# Altium schematic sheet ad_1.schdoc
size A2
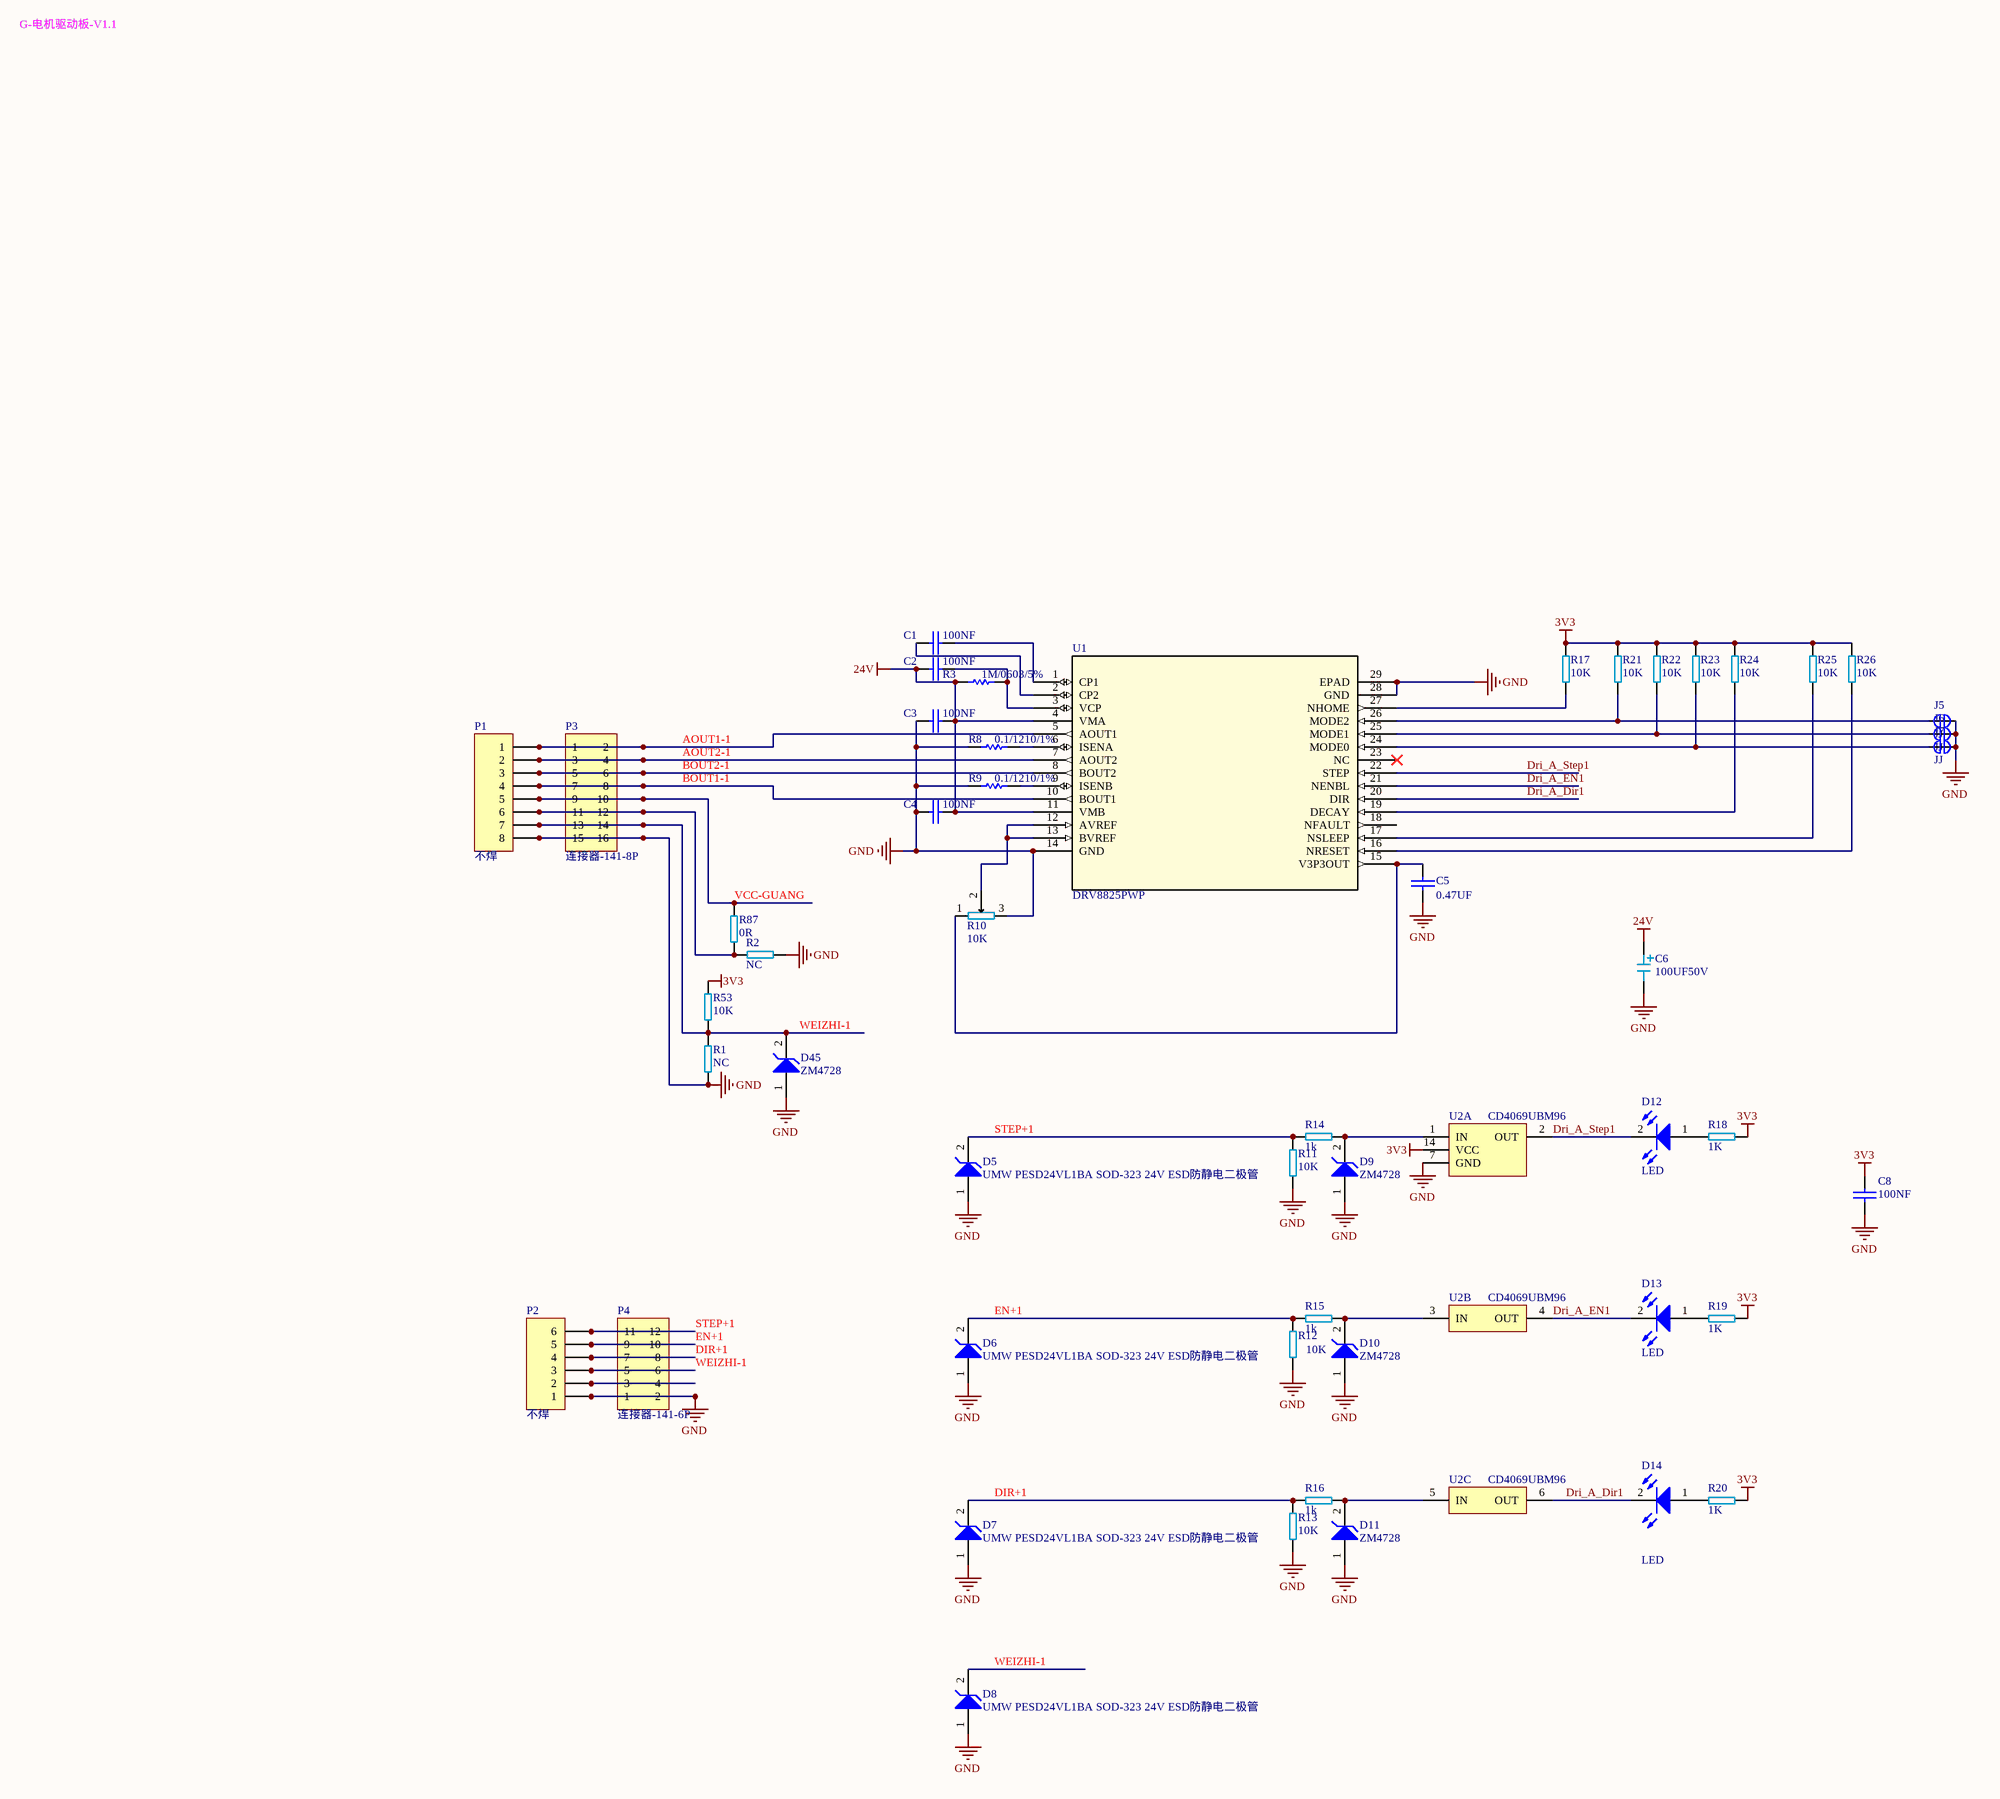
[diagram p0: ad_1.schdoc]

## Parts
C1  100NF  [C0603]
C2  100NF  [C0603]
C3  100NF  [C0603]
C4  100NF  [C0603]
C5  0.47UF  [C0603]
C6  100UF50V  [CE8]
C8  100NF  [C0603]
D5  UMW PESD24VL1BA SOD-323 24V ESD防静电二极管  [SOD323]
D6  UMW PESD24VL1BA SOD-323 24V ESD防静电二极管  [SOD323]
D7  UMW PESD24VL1BA SOD-323 24V ESD防静电二极管  [SOD323]
D8  UMW PESD24VL1BA SOD-323 24V ESD防静电二极管  [SOD323]
D9  ZM4728  [D1206]
D10  ZM4728  [D1206]
D11  ZM4728  [D1206]
D12  LED  [LED0603]
D13  LED  [LED0603]
D14  LED  [LED0603]
D45  ZM4728  [D1206]
J5  JJ  [TIAOXIAN-PAN]
J6  JJ  [TIAOXIAN-PAN]
J7  JJ  [TIAOXIAN-PAN]
P1  不焊  [SIP8]
P2  不焊  [SIP6]
P3  连接器-141-8P  [141V-8P]
P4  连接器-141-6P  [141V-6P]
R1  NC  [R0603]
R2  NC  [R0603]
R3  1M/0603/5%  [R0603]
R8  0.1/1210/1%  [R1210]
R9  0.1/1210/1%  [R1210]
R10  10K  [RR-MINI-SMD]
R11  10K  [R0603]
R12  10K  [R0603]
R13  10K  [R0603]
R14  1k  [R0603]
R15  1k  [R0603]
R16  1k  [R0603]
R17  10K  [R0603]
R18  1K  [R0603]
R19  1K  [R0603]
R20  1K  [R0603]
R21  10K  [R0603]
R22  10K  [R0603]
R23  10K  [R0603]
R24  10K  [R0603]
R25  10K  [R0603]
R26  10K  [R0603]
R53  10K  [R0603]
R87  0R  [R0603]
U1  DRV8825PWP  [HTSSOP28]
U2  CD4069UBM96  [SO14]  (parts A,B,C of 6)

## Nets
3V3: C8.2 R17.2 R18.2 R19.2 R20.2 R21.2 R22.2 R23.2 R24.2 R25.2 R26.2 R53.2 U2.14(VCC)
24V: C2.1 C3.2 C4.2 C6.1 R3.2 U1.4(VMA) U1.11(VMB)
GND: C3.1 C4.1 C5.1 C6.2 C8.1 D5.1 D6.1 D7.1 D8.1 D9.1 D10.1 D11.1 D45.1 J5.2 J6.2 J7.2 P1.8 P2.1 P3.15 P3.16 P4.1 P4.2 R1.1 R2.1 R8.2 R9.2 R10.3 R11.1 R12.1 R13.1 U1.14(GND) U1.28(GND) U1.29(EPAD) U2.7(GND)
AOUT1-1: P1.1 P3.1 P3.2 U1.5(AOUT1)
AOUT2-1: P1.2 P3.3 P3.4 U1.7(AOUT2)
BOUT1-1: P1.4 P3.7 P3.8 U1.10(BOUT1)
BOUT2-1: P1.3 P3.5 P3.6 U1.8(BOUT2)
DIR+1: D7.2 P2.4 P4.7 P4.8 R13.2 R16.2
Dri_A_Dir1: D14.2(K) U1.20(DIR) U2.6(OUT)
Dri_A_EN1: D13.2(K) U1.21(NENBL) U2.4(OUT)
Dri_A_Step1: D12.2(K) U1.22(STEP) U2.2(OUT)
EN+1: D6.2 P2.5 P4.9 P4.10 R12.2 R15.2
STEP+1: D5.2 P2.6 P4.11 P4.12 R11.2 R14.2
VCC-GUANG: P1.5 P3.9 P3.10 R87.2
WEIZHI-1: D8.2 D45.2 P1.7 P2.3 P3.13 P3.14 P4.5 P4.6 R1.2 R53.1
NetC1_1: C1.1 U1.2(CP2)
NetC1_2: C1.2 U1.1(CP1)
NetC2_2: C2.2 R3.1 U1.3(VCP)
NetC5_2: C5.2 R10.1 U1.15(V3P3OUT)
NetD9_2: D9.2 R14.1 U2.1(IN)
NetD10_2: D10.2 R15.1 U2.3(IN)
NetD11_2: D11.2 R16.1 U2.5(IN)
NetD12_1: D12.1(A) R18.1
NetD13_1: D13.1(A) R19.1
NetD14_1: D14.1(A) R20.1
NetJ5_1: J5.1 R21.1 U1.26(MODE2)
NetJ6_1: J6.1 R22.1 U1.25(MODE1)
NetJ7_1: J7.1 R23.1 U1.24(MODE0)
NetP1_6: P1.6 P3.11 P3.12 R2.2 R87.1
NetP2_2: P2.2 P4.3 P4.4
NetR8_1: R8.1 U1.6(ISENA)
NetR9_1: R9.1 U1.9(ISENB)
NetR10_2: R10.2 U1.12(AVREF) U1.13(BVREF)
NetR17_1: R17.1 U1.27(NHOME)
NetR24_1: R24.1 U1.19(DECAY)
NetR25_1: R25.1 U1.17(NSLEEP)
NetR26_1: R26.1 U1.16(NRESET)

Not connected (* = marked no-connect by the designer): U1 18(NFAULT) 23(NC)*

## Notes on the sheet
- Labels drawn without touching a wire or pin: G-电机驱动板-V1.1

## Library data of the parts
C1-C5 C8 = CAP: Capacitor
C6 = C+: 铝电解电容
D5-D11 D45 = TVS-SMA: 稳压管; Published: 8-Jun-2000; LatestRevisionDate: 17-Jul-2002; LatestRevisionNote: Re-released for DXP Platform.; DatasheetVersion: 1997; PackageReference: DO-35; Publisher: Altium Limited; PackageDescription: Diode, Axial; Body 3.8 x 1.9 mm (LxDia. max), Lead Dia. 0.53 mm (max); Code_JEDEC: DO-204-AH; ComponentLink1Description: Manufacturer Link; ComponentLink1URL: http://www.fairchildsemi.com/; ComponentLink2Description: Datasheet; ComponentLink2URL: http://www.fairchildsemi.com/ds/1N%2F1N4448.pdf
D12-D14 = LED0603: Published: 8-Jun-2000; LatestRevisionDate: 08-Jul-2005; LatestRevisionNote: Mech Layer 1 removed.; PackageReference: LED-0; Publisher: Altium Limited; PackageDescription: LED; 2 Leads
J5-J7 = JJ: 跳线
P1 = SIP8: 连接器; LatestRevisionDate: 17-Jul-2002; LatestRevisionNote: Re-released for DXP Platform.; Publisher: Altium Limited
P2 = SIP6: 连接器; LatestRevisionDate: 17-Jul-2002; LatestRevisionNote: Re-released for DXP Platform.; Publisher: Altium Limited
P3 = DIC16: 连接器; LatestRevisionDate: 17-Jul-2002; LatestRevisionNote: Re-released for DXP Platform.; Publisher: Altium Limited
P4 = DIC12: 连接器; LatestRevisionDate: 17-Jul-2002; LatestRevisionNote: Re-released for DXP Platform.; Publisher: Altium Limited
R1 R2 R11-R26 R53 R87 = R-0603: 贴片电阻
R3 R8 R9 = Res1: Resistor; Value: 1K; Published: 8-Jun-2000; LatestRevisionDate: 17-Jul-2002; LatestRevisionNote: Re-released for DXP Platform.; PackageReference: AXIAL-0.3; Publisher: Altium Limited; PackageDescription: Axial Device, Thru-Hole; 2 Leads; 0.3 in Pin Spacing
R10 = RR: 电位器
U1 = DRV8825PWP: 芯片
U2 = CD4069: 芯片